# EAGLE design carrier_board_simplified (EAGLE 9.2.1)
TITLE: Carrier Board

## Sheet 1 of 3: Slot 1
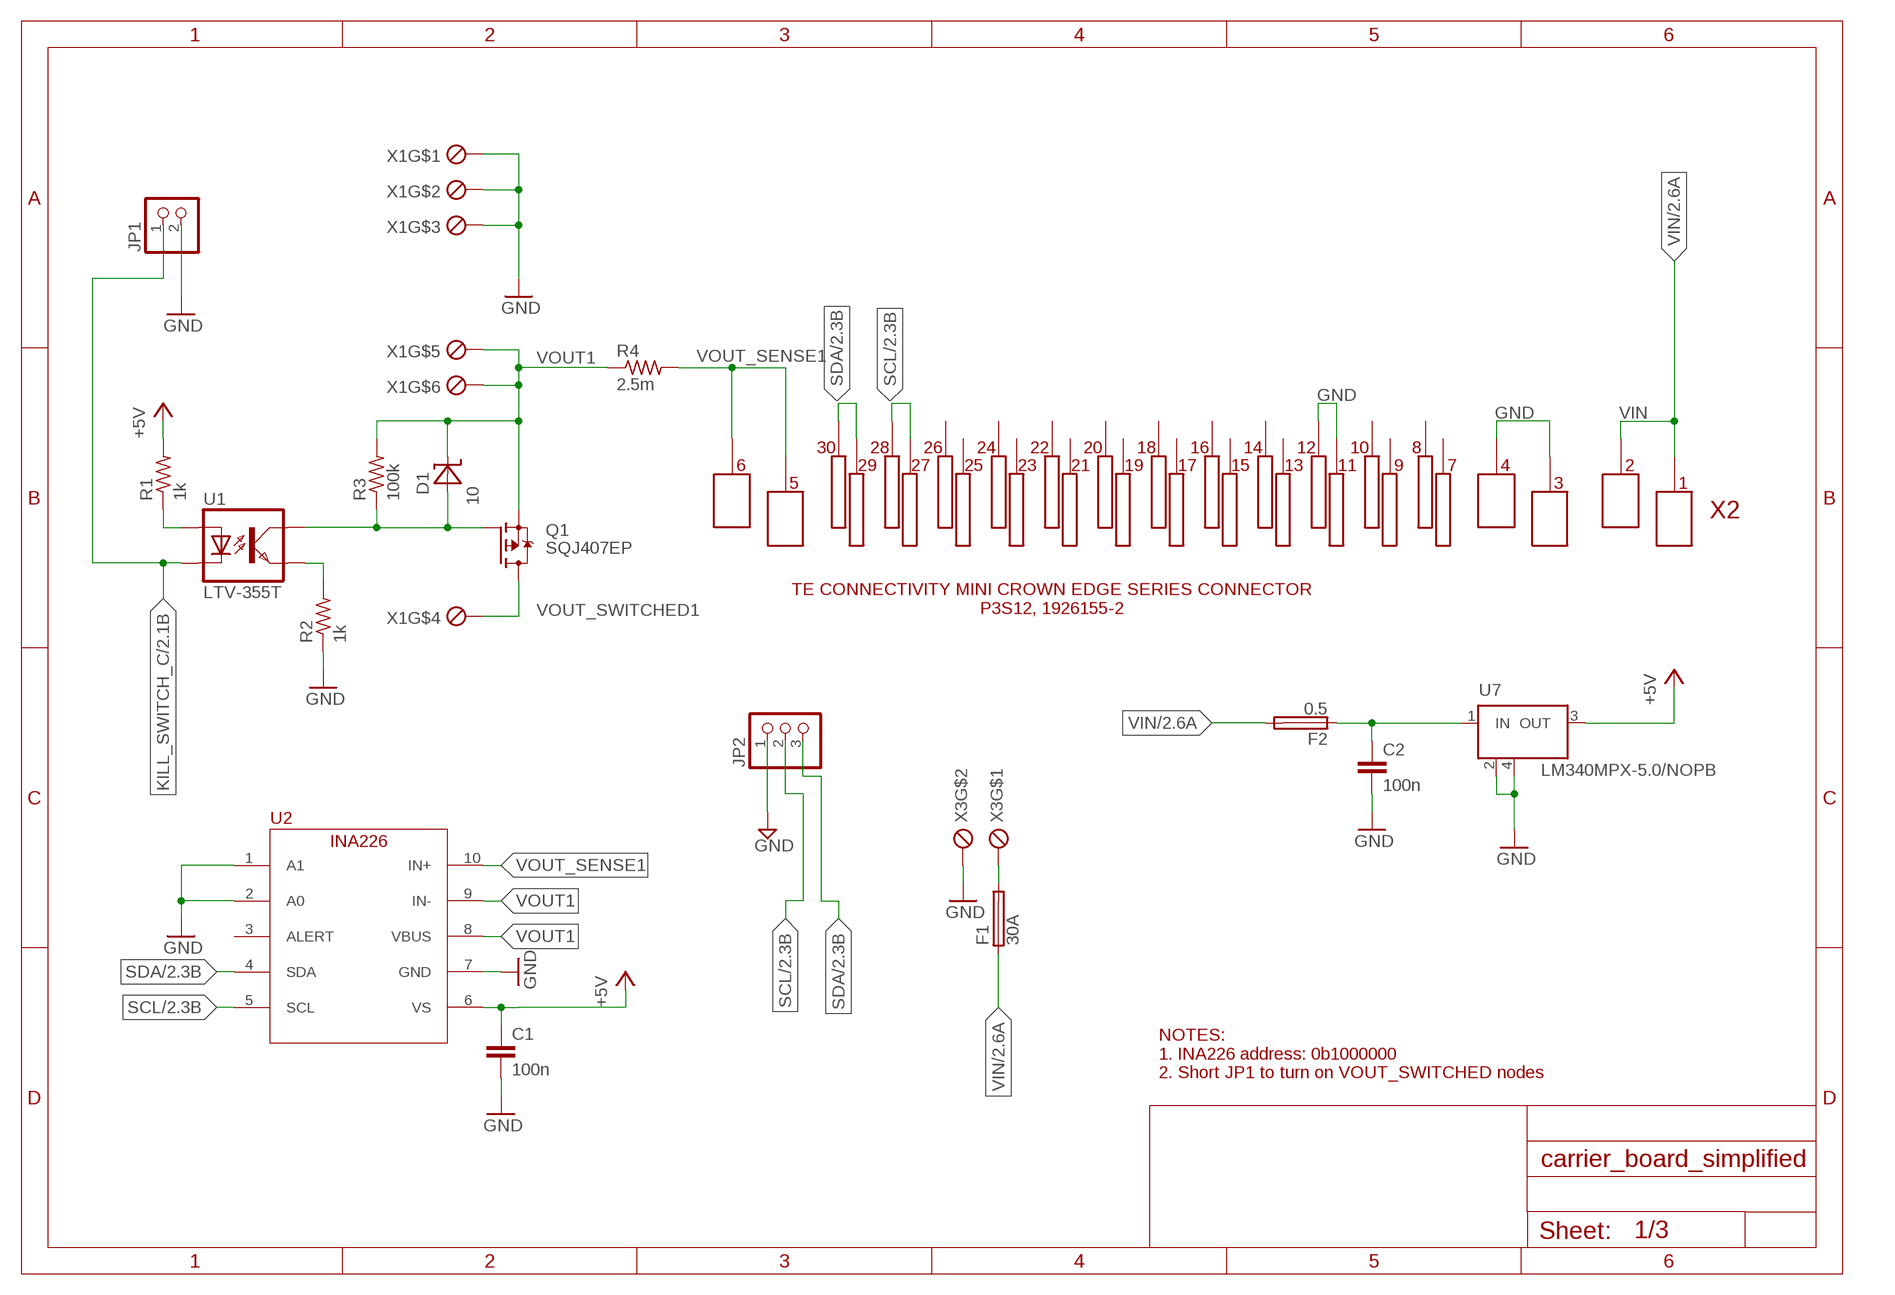
[diagram p0: schematic, sheet 1]

### Parts
C1  100n  C-EUC0603  [C0603]
C2  100n  C-EUC0603  [C0603]
D1  10  BZT52C10-TP  [SOD123]
F1  30A  3557-10  [3557-10]
F2  0.5  501_FUSE  [R1206]
JP1  PINHD-1X02_2.54-SMD-90°  [1X02SMD/90]
JP2  PINHD-1X03_2.54-SMD-90°  [1X03SMD/90]
Q1  SQJ407EP  [POWERPAK_SO8L_SINGLE]
R1  1k  R-US_R0603  [R0603]
R2  1k  R-US_R0603  [R0603]
R3  100k  R-US_R0603  [R0603]
R4  2.5m  R-US_R2512  [R2512]
U1  LTV-355T  [SMD4]
U2  INA226  [MSOP10]
U7  LM340MPX-5.0/NOPB  LM340S  [SOT223]
X1  284391-6  [284391-6]
X2  1926155-2_SOCK  [1926155-2_SOCK]
X3  OSTT7020150  [OSTT7020150]

### Nets
+5V: C1.1 R1.2 U2.6(VS) U7.3(OUT) ; also sheet 2,3
GATE_VOUT1: D1.2(A) Q1.P$4(G) R3.1 U1.COLLECTOR(COL)
GND: C1.2 C2.2 JP1.2 JP2.1 R2.1 U2.1(A1) U2.2(A0) U2.7(GND) U7.2(GND) U7.4(GND) X1.P$1 X1.P$2 X1.P$3 X2.P$3_1 X2.P$3_2 X2.P$3_3 X2.P$4_1 X2.P$4_2 X2.P$4_3 X2.P$11 X2.P$12 X3.2 ; also sheet 2,3
KILL_SWITCH_C: JP1.1 U1.CATHODE(C) ; also sheet 2,3
N$1: C2.1 F2.1 U7.1(IN)
N$2: R2.2 U1.EMITTER(EMIT)
N$4: R1.1 U1.ANODE(A)
SCL: JP2.2 U2.5(SCL) X2.P$27 X2.P$28 ; also sheet 2,3
SDA: JP2.3 U2.4(SDA) X2.P$29 X2.P$30 ; also sheet 2,3
VBAT1: F1.P$3 F1.P$4 X3.1
VIN: F1.P$1 F1.P$2 F2.2 X2.P$1_1 X2.P$1_2 X2.P$1_3 X2.P$2_1 X2.P$2_2 X2.P$2_3 ; also sheet 2,3
VOUT1: D1.1(C) Q1.P$1(S) Q1.P$2(S) Q1.P$3(S) R3.2 R4.1 U2.8(VBUS) U2.9(IN-) X1.P$5 X1.P$6
VOUT_SENSE1: R4.2 U2.10(IN+) X2.P$5_1 X2.P$5_2 X2.P$5_3 X2.P$6_1 X2.P$6_2 X2.P$6_3
VOUT_SWITCHED1: Q1.P$5(D) Q1.P$6(D) Q1.P$7(D) Q1.P$8(D) X1.P$4
Unconnected: U2.3(ALERT) X2.P$7 X2.P$8 X2.P$9 X2.P$10 X2.P$13 X2.P$14 X2.P$15 X2.P$16 X2.P$17 X2.P$18 X2.P$19 X2.P$20 X2.P$21 X2.P$22 X2.P$23 X2.P$24 X2.P$25 X2.P$26

### Notes on the sheet
- NOTES:
  1. INA226 address: 0b1000000
  2. Short JP1 to turn on VOUT_SWITCHED nodes

## Sheet 2 of 3: Slot 2
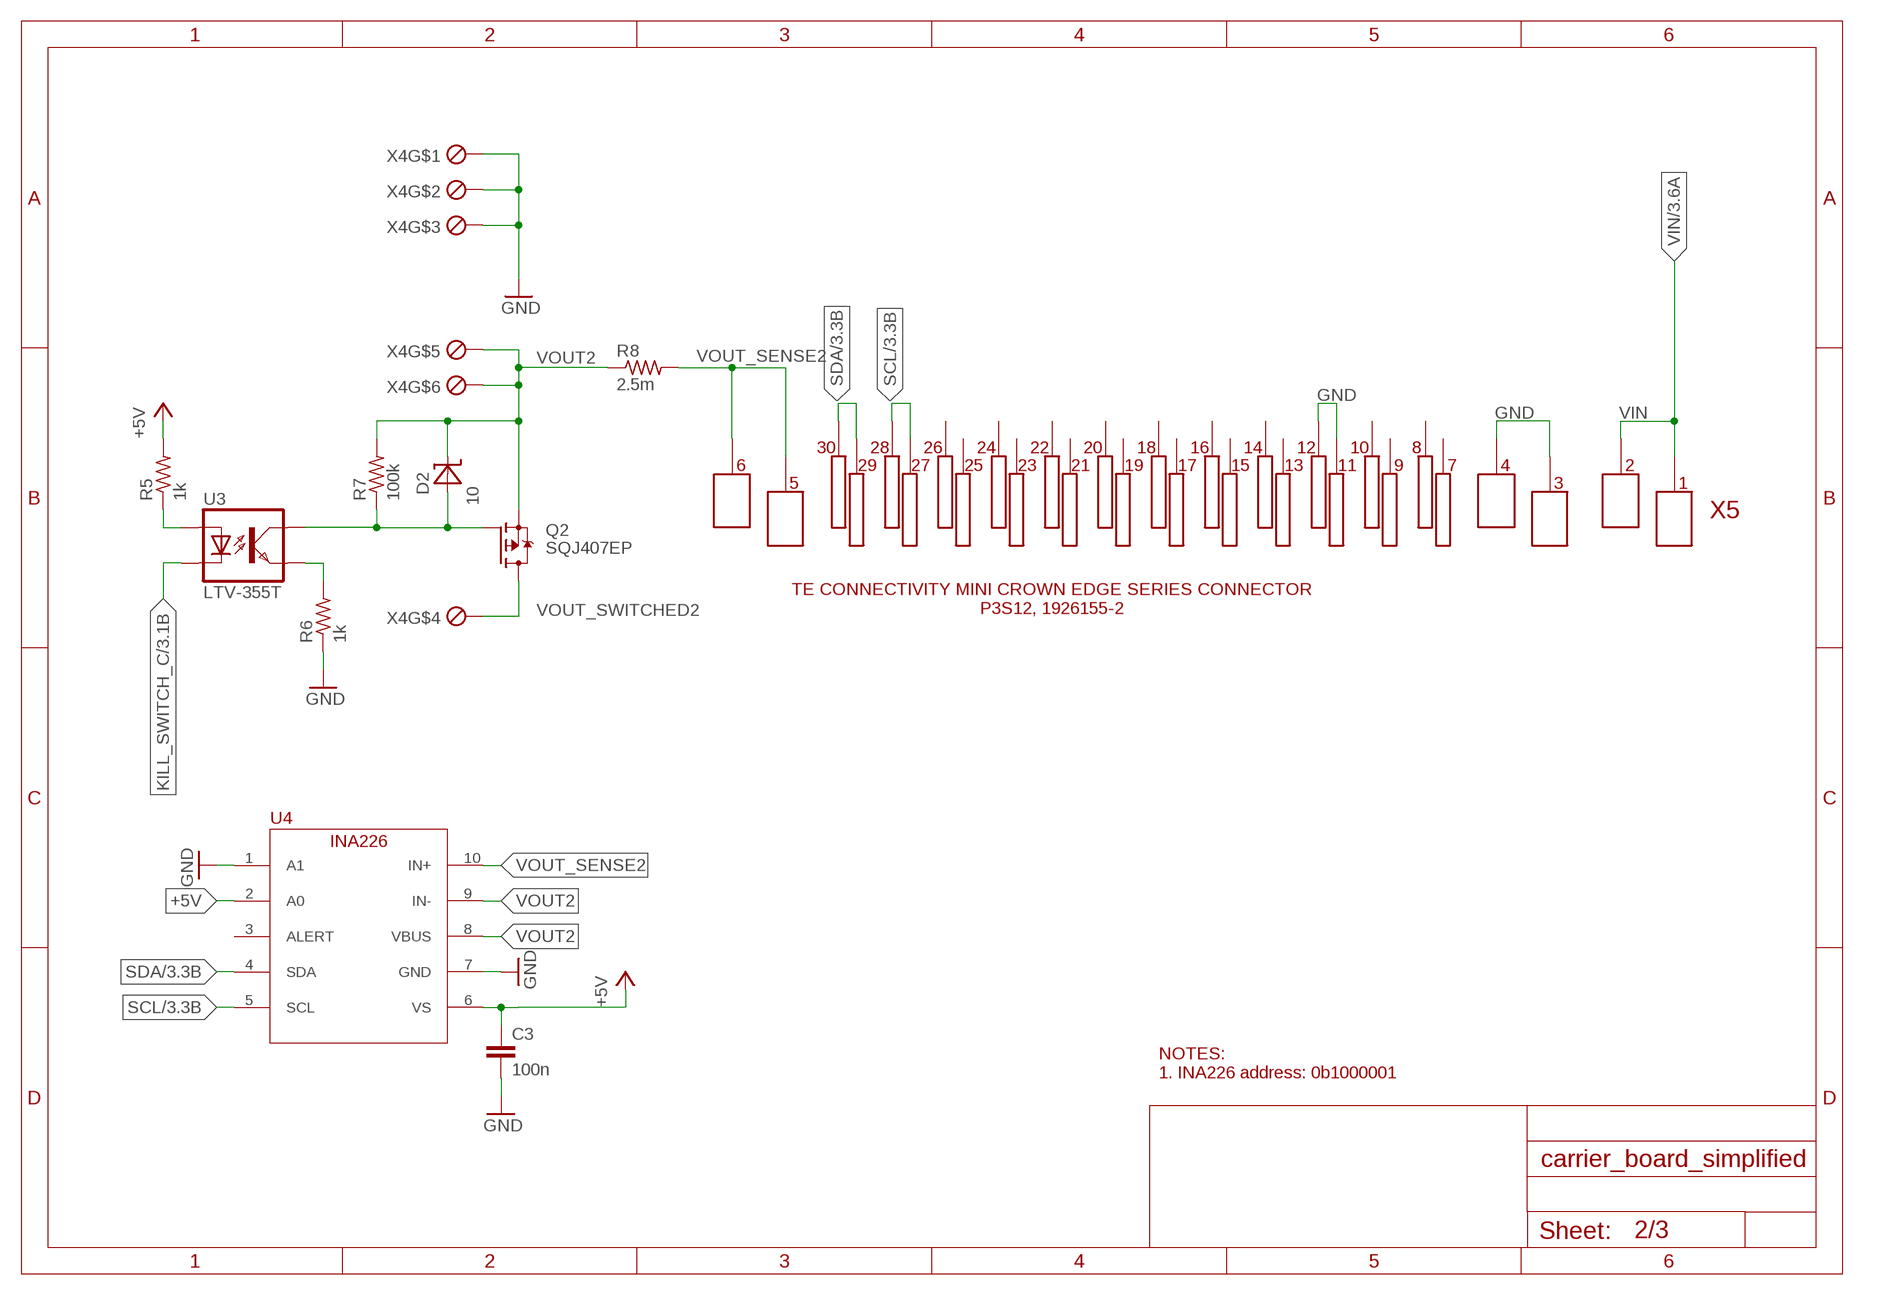
[diagram p1: schematic, sheet 2]

### Parts
C3  100n  C-EUC0603  [C0603]
D2  10  BZT52C10-TP  [SOD123]
Q2  SQJ407EP  [POWERPAK_SO8L_SINGLE]
R5  1k  R-US_R0603  [R0603]
R6  1k  R-US_R0603  [R0603]
R7  100k  R-US_R0603  [R0603]
R8  2.5m  R-US_R2512  [R2512]
U3  LTV-355T  [SMD4]
U4  INA226  [MSOP10]
X4  284391-6  [284391-6]
X5  1926155-2_SOCK  [1926155-2_SOCK]

### Nets
+5V: C3.1 R5.2 U4.2(A0) U4.6(VS) ; also sheet 1,3
GATE_VOUT2: D2.2(A) Q2.P$4(G) R7.1 U3.COLLECTOR(COL)
GND: C3.2 R6.1 U4.1(A1) U4.7(GND) X4.P$1 X4.P$2 X4.P$3 X5.P$3_1 X5.P$3_2 X5.P$3_3 X5.P$4_1 X5.P$4_2 X5.P$4_3 X5.P$11 X5.P$12 ; also sheet 1,3
KILL_SWITCH_C: U3.CATHODE(C) ; also sheet 1,3
N$7: R6.2 U3.EMITTER(EMIT)
N$8: R5.1 U3.ANODE(A)
SCL: U4.5(SCL) X5.P$27 X5.P$28 ; also sheet 1,3
SDA: U4.4(SDA) X5.P$29 X5.P$30 ; also sheet 1,3
VIN: X5.P$1_1 X5.P$1_2 X5.P$1_3 X5.P$2_1 X5.P$2_2 X5.P$2_3 ; also sheet 1,3
VOUT2: D2.1(C) Q2.P$1(S) Q2.P$2(S) Q2.P$3(S) R7.2 R8.1 U4.8(VBUS) U4.9(IN-) X4.P$5 X4.P$6
VOUT_SENSE2: R8.2 U4.10(IN+) X5.P$5_1 X5.P$5_2 X5.P$5_3 X5.P$6_1 X5.P$6_2 X5.P$6_3
VOUT_SWITCHED2: Q2.P$5(D) Q2.P$6(D) Q2.P$7(D) Q2.P$8(D) X4.P$4
Unconnected: U4.3(ALERT) X5.P$7 X5.P$8 X5.P$9 X5.P$10 X5.P$13 X5.P$14 X5.P$15 X5.P$16 X5.P$17 X5.P$18 X5.P$19 X5.P$20 X5.P$21 X5.P$22 X5.P$23 X5.P$24 X5.P$25 X5.P$26

### Notes on the sheet
- NOTES:
  1. INA226 address: 0b1000001

## Sheet 3 of 3: Slot 3
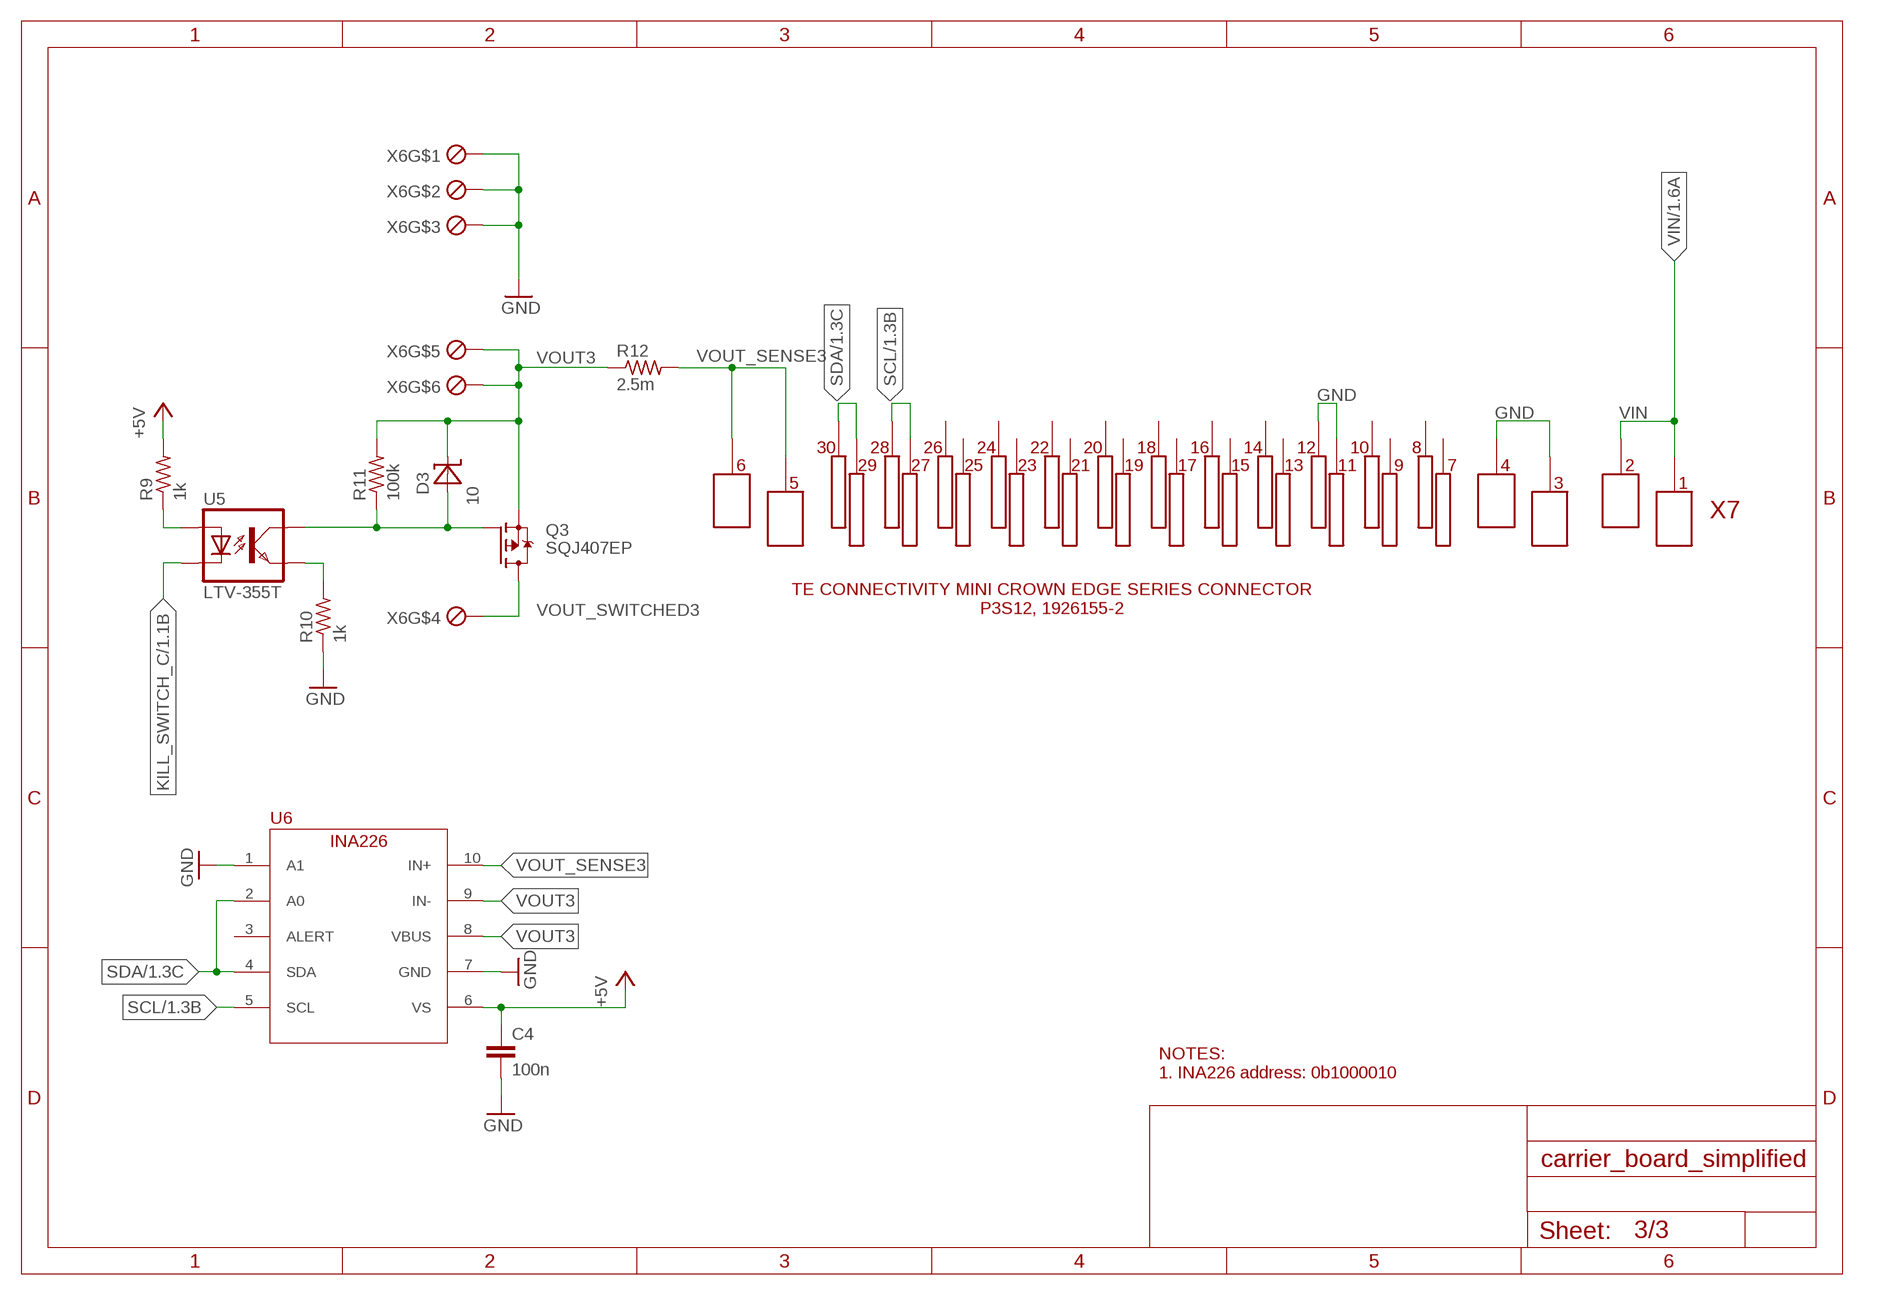
[diagram p2: schematic, sheet 3]

### Parts
C4  100n  C-EUC0603  [C0603]
D3  10  BZT52C10-TP  [SOD123]
Q3  SQJ407EP  [POWERPAK_SO8L_SINGLE]
R9  1k  R-US_R0603  [R0603]
R10  1k  R-US_R0603  [R0603]
R11  100k  R-US_R0603  [R0603]
R12  2.5m  R-US_R2512  [R2512]
U5  LTV-355T  [SMD4]
U6  INA226  [MSOP10]
X6  284391-6  [284391-6]
X7  1926155-2_SOCK  [1926155-2_SOCK]

### Nets
+5V: C4.1 R9.2 U6.6(VS) ; also sheet 1,2
GATE_VOUT3: D3.2(A) Q3.P$4(G) R11.1 U5.COLLECTOR(COL)
GND: C4.2 R10.1 U6.1(A1) U6.7(GND) X6.P$1 X6.P$2 X6.P$3 X7.P$3_1 X7.P$3_2 X7.P$3_3 X7.P$4_1 X7.P$4_2 X7.P$4_3 X7.P$11 X7.P$12 ; also sheet 1,2
KILL_SWITCH_C: U5.CATHODE(C) ; also sheet 1,2
N$13: R10.2 U5.EMITTER(EMIT)
N$14: R9.1 U5.ANODE(A)
SCL: U6.5(SCL) X7.P$27 X7.P$28 ; also sheet 1,2
SDA: U6.2(A0) U6.4(SDA) X7.P$29 X7.P$30 ; also sheet 1,2
VIN: X7.P$1_1 X7.P$1_2 X7.P$1_3 X7.P$2_1 X7.P$2_2 X7.P$2_3 ; also sheet 1,2
VOUT3: D3.1(C) Q3.P$1(S) Q3.P$2(S) Q3.P$3(S) R11.2 R12.1 U6.8(VBUS) U6.9(IN-) X6.P$5 X6.P$6
VOUT_SENSE3: R12.2 U6.10(IN+) X7.P$5_1 X7.P$5_2 X7.P$5_3 X7.P$6_1 X7.P$6_2 X7.P$6_3
VOUT_SWITCHED3: Q3.P$5(D) Q3.P$6(D) Q3.P$7(D) Q3.P$8(D) X6.P$4
Unconnected: U6.3(ALERT) X7.P$7 X7.P$8 X7.P$9 X7.P$10 X7.P$13 X7.P$14 X7.P$15 X7.P$16 X7.P$17 X7.P$18 X7.P$19 X7.P$20 X7.P$21 X7.P$22 X7.P$23 X7.P$24 X7.P$25 X7.P$26

### Notes on the sheet
- NOTES:
  1. INA226 address: 0b1000010

## Library data of the parts
C1-C4 = rcl:C-EU: CAPACITOR, European symbol; SPICEPREFIX: C
D1-D3 = LTM4607:BZT52C10-TP
F1 = LTM4607:3557-10
F2 = LTM4607:501_FUSE
JP1 = pinhead-2:PINHD-1X02: PIN HEADER
JP2 = pinhead-2:PINHD-1X03: PIN HEADER
Q1-Q3 = LTM4607:SQJ407EP
R1-R12 = rcl:R-US_: RESISTOR, American symbol; SPICEPREFIX: R
U1 U3 U5 = dropper_torpedo_v3:LTV-355T
U2 U4 U6 = LTM4607:INA226
U7 = linear:LM340S: 3-Terminal Positive Regulators Source: http://cache.national.com/ds/LM/LM340.pdf
X1 X4 X6 = LTM4607:284391-6
X2 X5 X7 = LTM4607:1926155-2_SOCK
X3 = LTM4607:OSTT7020150

## Net classes
1 net1: clearance 0.203 mm to class 0

## Board
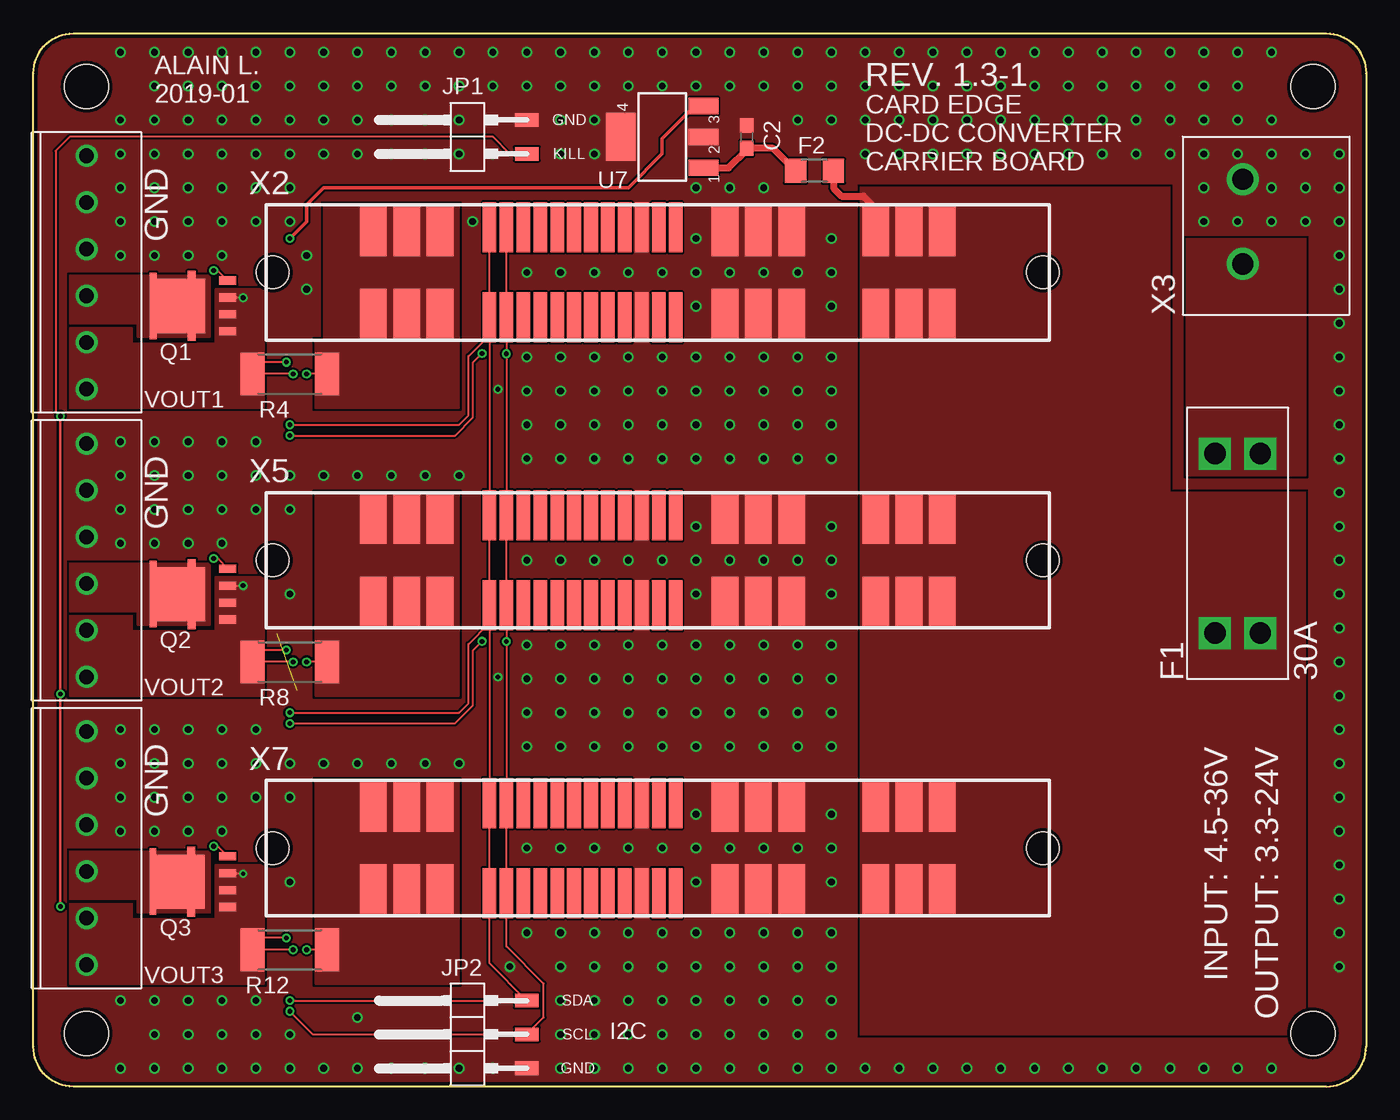
[diagram p3: board, top side]
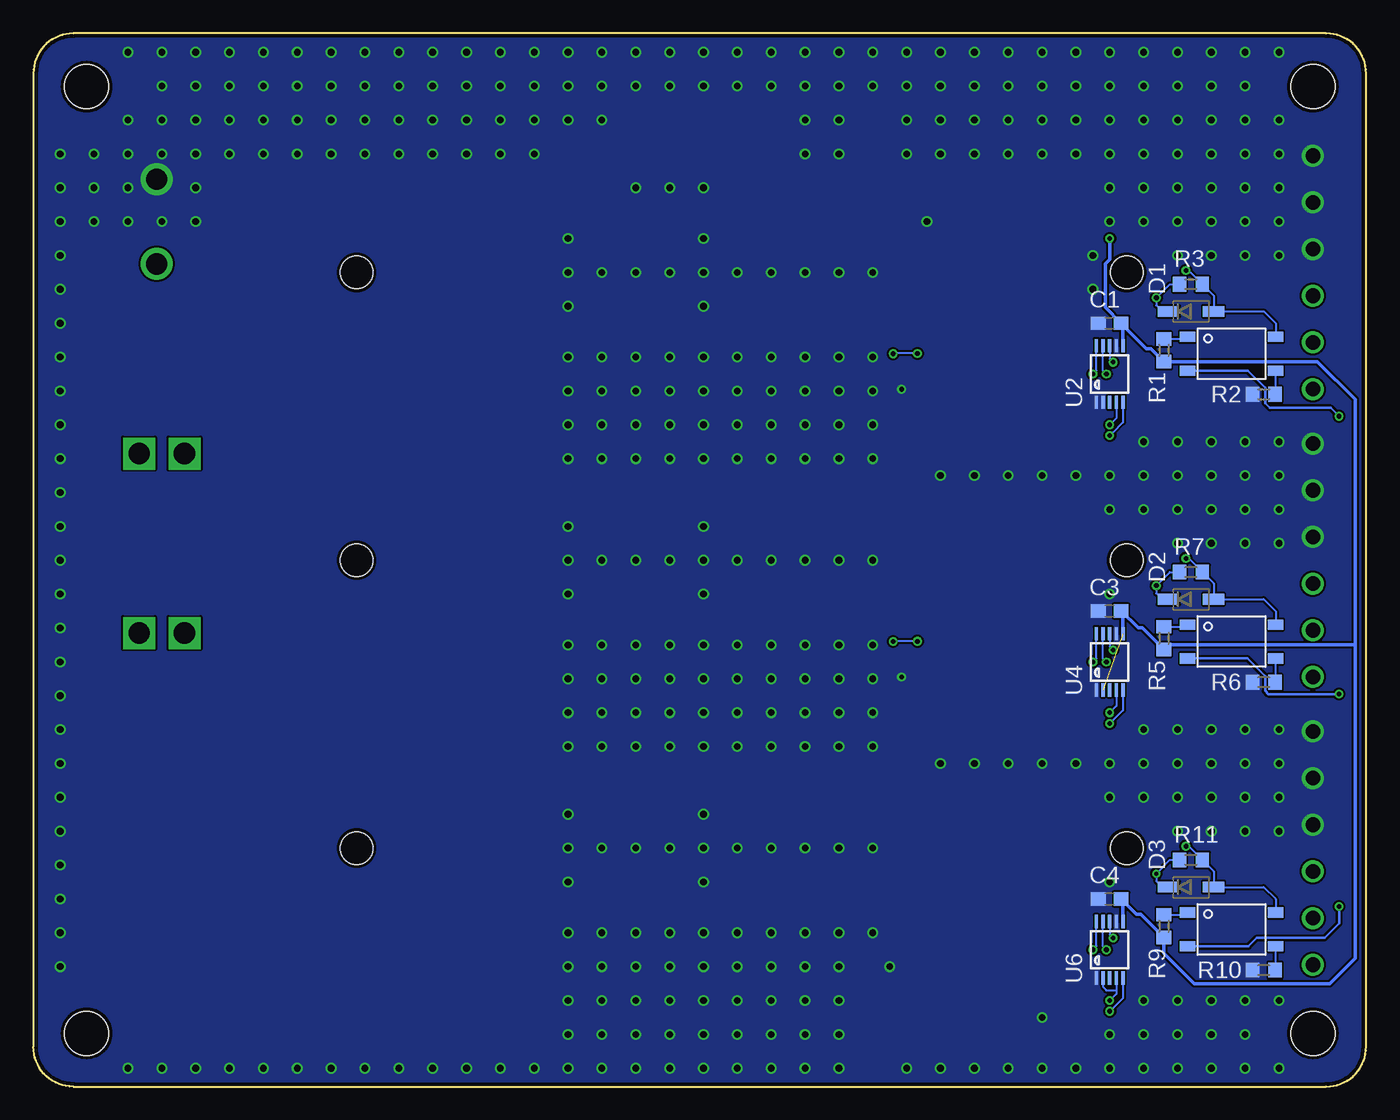
[diagram p4: board, bottom side, seen from below]

Size 100 x 79 mm. Coordinates in mm from the lower left corner, seen from the top.
Outline: 0,3 0,76 arc-90 3,79 97,79 arc-90 100,76 100,3 arc-90 97,0 3,0 arc-90 0,3
Copper layers (1*16): Top 0.035mm / dielectric 1.5mm / Bottom 0.035mm
Design rules "JLCPCB2Layer *": minimum track width 6mil, minimum drill 10mil, track to track 6mil, track to pad 6mil, pad to pad 6mil, via to via 6mil, smd to smd 0mil, copper to edge 10mil, drill to drill 10mil, minimum pad ring 6mil, minimum via ring 6mil, stop-mask expansion 2mil, vias tented up to drill 100mil, thermal gap 10mil

### Footprints (pad centres in the part's own frame; a part is rotated, then mirrored left to right if it is on the bottom)
C0603 = smd 1.1 x 1: 1 -0.85,0; 2 0.85,0
SOD123 = smd 1.6 x 0.8: 1 -1.7,0; 2 1.7,0
3557-10 = drill 1.6 square: P$1 -6.731,-1.702; P$2 -6.731,1.702; P$3 6.731,-1.702; P$4 6.731,1.702
R1206 = smd 1.6 x 1.803: 1 -1.422,0; 2 1.422,0
1X02SMD/90 = smd 1.016 x 1.778: 1 -1.27,-5.08; 2 1.27,-5.08
1X03SMD/90 = smd 1.016 x 1.778: 1 -1.27,-5.08; 2 1.27,-5.08; 3 3.81,-5.08
POWERPAK_SO8L_SINGLE = smd 0.61 x 1.27: P$1 -1.905,0; P$2 -0.635,0; P$3 0.635,0; P$4 1.905,0 | smd 4.061 x 3.63: P$5 0,3.527 | smd 0.595 x 0.61: P$6 -2.328,2.715; P$7 2.328,2.715 | smd 5 x 0.51: P$8 0,5.596
R0603 = smd 1 x 1.1: 1 -0.85,0; 2 0.85,0
R2512 = smd 1.8 x 3.2: 1 -2.8,0; 2 2.8,0
SMD4 = smd 0.762 x 1.143: ANODE -1.27,-3.302; CATHODE 1.27,-3.302; COLLECTOR -1.27,3.302; EMITTER 1.27,3.302
MSOP10 = smd 0.25 x 1: 1 -1,-2.113; 2 -0.5,-2.113; 3 0,-2.113; 4 0.5,-2.113; 5 1,-2.113; 6 1,2.113; 7 0.5,2.113; 8 0,2.113; 9 -0.5,2.113; 10 -1,2.113
SOT223 = smd 1.219 x 2.235: 1 -2.311,-3.099; 2 0,-3.099; 3 2.311,-3.099 | smd 3.6 x 2.2: 4 0,3.099
STAND-OFF = hole 3.302: 0,0
284391-6 = drill 1.1: P$1 -8.75,0; P$2 -5.25,0; P$3 -1.75,0; P$4 1.75,0; P$5 5.25,0; P$6 8.75,0
1926155-2_SOCK = smd 2 x 3.75: P$1_1 50.22,-3.1; P$1_2 47.72,-3.1; P$1_3 45.22,-3.1; P$2_1 50.22,3.1; P$2_2 47.72,3.1; P$2_3 45.22,3.1; P$3_1 38.92,-3.1; P$3_2 36.42,-3.1; P$3_3 33.92,-3.1; P$4_1 38.92,3.1; P$4_2 36.42,3.1; P$4_3 33.92,3.1; P$5_1 12.55,-3.1; P$5_2 10.05,-3.1; P$5_3 7.55,-3.1; P$6_1 12.55,3.1; P$6_2 10.05,3.1; P$6_3 7.55,3.1 | smd 1.02 x 3.75: P$7 30.22,-3.375; P$8 30.22,3.375; P$9 28.95,-3.375; P$10 28.95,3.375; P$11 27.68,-3.375; P$12 27.68,3.375; P$13 26.41,-3.375; P$14 26.41,3.375; P$15 25.14,-3.375; P$16 25.14,3.375; P$17 23.87,-3.375; P$18 23.87,3.375; P$19 22.6,-3.375; P$20 22.6,3.375; P$21 21.33,-3.375; P$22 21.33,3.375; P$23 20.06,-3.375; P$24 20.06,3.375; P$25 18.79,-3.375; P$26 18.79,3.375; P$27 17.52,-3.375; P$28 17.52,3.375; P$29 16.25,-3.375; P$30 16.25,3.375 | hole 2.44: 57.77,0; 0,0
OSTT7020150 = drill 1.6: 1 0,0; 2 6.35,0

### Placement (x,y rotation side)
C1  19.24,57.26 180 bottom
C2  53.53,71.23 90 top
C3  19.24,35.67 180 bottom
C4  19.24,14.08 180 bottom
D1  13.14,58.15 0 bottom
D2  13.14,36.56 0 bottom
D3  13.14,14.97 0 bottom
F1  90.36,40.75 90 top
F2  58.61,68.69 0 top
JP1  31.94,71.23 90 top
JP2  31.94,2.65 90 top
Q1  14.59,58.56 90 top
Q2  14.59,36.94 90 top
Q3  14.57,15.38 90 top
R1  15.18,55.23 270 bottom
R2  7.68,51.93 0 bottom
R3  13.14,60.18 180 bottom
R4  19.24,53.45 0 top
R5  15.18,33.64 270 bottom
R6  7.68,30.34 0 bottom
R7  13.14,38.59 180 bottom
R8  19.24,31.86 0 top
R9  15.18,12.05 270 bottom
R10  7.68,8.75 0 bottom
R11  13.14,17 180 bottom
R12  19.24,10.27 0 top
U1  10.1,54.97 270 bottom
U2  19.24,53.45 0 bottom
U3  10.1,33.38 270 bottom
U4  19.24,31.86 0 bottom
U5  10.1,11.79 270 bottom
U6  19.24,10.27 0 bottom
U7  47.18,71.23 90 top
U$1  [STAND-OFF]  4,4 0 top
U$2  [STAND-OFF]  96,4 0 top
U$3  [STAND-OFF]  4,75 0 top
U$4  [STAND-OFF]  96,75 0 top
U$5  [A4L-LOC]  -50.61,-49.42 0 top  (outside the outline)
X1  4,61.07 270 top
X2  17.97,61.07 0 top
X3  90.74,61.7 90 top
X4  4,39.48 270 top
X5  17.97,39.48 0 top
X6  4,17.89 270 top
X7  17.97,17.89 0 top

### Tracks (layer width: path | path; a pad name or v marks a point on that pad's centre or on a via)
+5V  (via drill 0.35)  (1 unrouted)
  Top 0.254: U7.3 49.62,73.54 47.18,71.1 47.18,69.96 44.64,67.42 21.78,67.42 20.51,66.15 20.51,64.88 v19.24,63.61
  Bottom 0.254: v19.24,63.61 19.24,62.06 19.57,61.73 19.57,58.44 C1.1 | C1.1 18.24,57.11 U2.6 | C1.1 16.48,55.36 16.15,55.36 R1.2 3.66,54.38 0.83,51.55 0.83,33.13 | 0.83,33.13 0.83,9.63 2.73,7.73 12.89,7.73 15.18,10.02 R9.2 16.92,12.94 17.25,12.94 C4.1 18.24,13.93 U6.6 | U4.6 18.24,35.52 C3.1 18.35,35.67 17.08,34.4 16.79,34.4 R5.2 14.83,33.13 4.46,33.13 3.54,33.13 0.83,33.13
GATE_VOUT1  (via drill 0.35)
  Top 0.152: Q1.P$4 13.84,61.21 v13.53,61.21
  Bottom 0.152: U1.COLLECTOR 6.79,57.26 7.68,58.15 D1.2 11.44,59.33 R3.1 13.32,61.21 v13.53,61.21
GATE_VOUT2  (via drill 0.35)
  Top 0.152: Q2.P$4 13.82,39.62 v13.53,39.62
  Bottom 0.152: U3.COLLECTOR 6.79,35.67 7.68,36.56 D2.2 11.44,37.74 R7.1 13.32,39.62 v13.53,39.62
GATE_VOUT3  (via drill 0.35)
  Top 0.152: Q3.P$4 13.82,18.03 v13.53,18.03
  Bottom 0.152: U5.COLLECTOR 6.79,14.08 7.68,14.97 D3.2 11.44,16.15 R11.1 13.32,18.03 v13.53,18.03
GND  (via drill 0.35, 0.5)
  other vias: 19.24,64.88 16.7,64.88 14.16,64.88 11.62,64.88 9.08,64.88 6.54,64.88 6.54,62.34 9.08,62.34 11.62,62.34 14.16,62.34 20.51,62.34 20.51,59.8 6.54,48.37 9.08,48.37 11.62,48.37 14.16,48.37 16.7,48.37 16.7,45.83 14.16,45.83 11.62,45.83 9.08,45.83 6.54,45.83 6.54,43.29 9.08,43.29 11.62,43.29 14.16,43.29 16.7,43.29 19.24,43.29 19.24,45.83 21.78,45.83 24.32,45.83 26.86,45.83 29.4,45.83 31.94,45.83 6.54,40.75 9.08,40.75 11.62,40.75 14.16,40.75 6.54,26.78 9.08,26.78 11.62,26.78 14.16,26.78 14.16,24.24 11.62,24.24 9.08,24.24 6.54,24.24 6.54,21.7 9.08,21.7 11.62,21.7 14.16,21.7 6.54,19.16 9.08,19.16 11.62,19.16 14.16,19.16 16.7,26.78 16.7,24.24 16.7,21.7 19.24,21.7 19.24,24.24 21.78,24.24 24.32,24.24 26.86,24.24 29.4,24.24 31.94,24.24 49.72,33.13 52.26,33.13 54.8,33.13 57.34,33.13 57.34,30.59 54.8,30.59 52.26,30.59 49.72,30.59 49.72,28.05 52.26,28.05 54.8,28.05 57.34,28.05 49.72,25.51 52.26,25.51 54.8,25.51 57.34,25.51 44.64,33.13 47.18,33.13 47.18,30.59 44.64,30.59 44.64,28.05 47.18,28.05 44.64,25.51 47.18,25.51 59.88,33.13 59.88,30.59 59.88,28.05 59.88,25.51 49.72,54.72 52.26,54.72 54.8,54.72 57.34,54.72 57.34,52.18 54.8,52.18 52.26,52.18 49.72,52.18 49.72,49.64 52.26,49.64 54.8,49.64 57.34,49.64 49.72,47.1 52.26,47.1 54.8,47.1 57.34,47.1 44.64,54.72 47.18,54.72 47.18,52.18 44.64,52.18 44.64,49.64 47.18,49.64 44.64,47.1 47.18,47.1 59.88,54.72 59.88,52.18 59.88,49.64 59.88,47.1 49.72,11.54 52.26,11.54 54.8,11.54 57.34,11.54 57.34,9 54.8,9 52.26,9 49.72,9 49.72,6.46 52.26,6.46 54.8,6.46 57.34,6.46 49.72,3.92 52.26,3.92 54.8,3.92 57.34,3.92 44.64,11.54 47.18,11.54 47.18,9 44.64,9 44.64,6.46 47.18,6.46 44.64,3.92 47.18,3.92 59.88,11.54 59.88,9 59.88,6.46 59.88,3.92 42.1,11.54 39.56,11.54 37.02,11.54 39.56,9 42.1,9 42.1,6.46 42.1,3.92 42.1,1.38 44.64,1.38 47.18,1.38 49.72,1.38 52.26,1.38 54.8,1.38 57.34,1.38 59.88,1.38 62.42,1.38 64.96,1.38 67.5,1.38 70.04,1.38 72.58,1.38 75.12,1.38 77.66,1.38 80.2,1.38 85.28,1.38 82.74,1.38 87.82,1.38 90.36,1.38 92.9,1.38 39.56,1.38 34.48,1.38 31.94,1.38 29.4,1.38 26.86,1.38 24.32,1.38 21.78,1.38 19.24,1.38 16.7,1.38 14.16,1.38 11.62,1.38 9.08,1.38 6.54,1.38 11.62,3.92 97.98,9 97.98,11.54 97.98,14.08 97.98,16.62 97.98,19.16 97.98,21.7 97.98,24.24 97.98,26.78 97.98,29.32 97.98,31.86 97.98,34.4 97.98,36.94 97.98,39.48 97.98,42.02 97.98,47.1 97.98,44.56 97.98,49.64 97.98,52.18 97.98,54.72 97.98,57.26 97.98,59.8 59.88,20.43 59.88,17.89 59.88,15.35 57.34,17.89 54.8,17.89 52.26,17.89 49.72,17.89 49.72,20.43 49.72,15.35 59.88,39.48 59.88,36.94 59.88,42.02 57.34,39.48 54.8,39.48 52.26,39.48 49.72,39.48 49.72,42.02 49.72,36.94 59.88,61.07 57.34,61.07 59.88,63.61 59.88,58.53 54.8,61.07 52.26,61.07 49.72,61.07 49.72,63.61 49.72,58.53 6.54,6.46 37.02,54.72 34.86,52.31 34.86,30.72 19.24,15.35 19.24,36.94 32.96,64.88 97.98,64.88 97.98,62.34 14.16,3.92 16.7,3.92 19.24,3.92 24.32,5.19 39.56,6.46 39.56,3.92 14.16,6.46 16.7,6.46 42.1,33.13 42.1,30.59 42.1,28.05 42.1,25.51 37.02,33.13 39.56,33.13 39.56,30.59 37.02,30.59 37.02,28.05 39.56,28.05 37.02,25.51 39.56,25.51 42.1,54.72 42.1,52.18 42.1,49.64 42.1,47.1 39.56,54.72 39.56,52.18 37.02,52.18 37.02,49.64 39.56,49.64 37.02,47.1 39.56,47.1 35.75,9 11.62,67.42 9.08,67.42 6.54,67.42 14.16,67.42 16.7,67.42 19.24,67.42 19.24,69.96 16.7,69.96 14.16,69.96 11.62,69.96 9.08,69.96 6.54,69.96 21.78,69.96 24.32,69.96 26.86,69.96 29.4,69.96 31.94,69.96 34.48,69.96 39.56,69.96 42.1,69.96 42.1,72.5 39.56,72.5 6.54,72.5 9.08,72.5 11.62,72.5 14.16,72.5 16.7,72.5 19.24,72.5 21.78,72.5 24.32,72.5 26.86,72.5 29.4,72.5 31.94,72.5 34.48,72.5 9.08,75.04 9.08,77.58 11.62,77.58 11.62,75.04 14.16,75.04 14.16,77.58 16.7,77.58 16.7,75.04 19.24,75.04 19.24,77.58 21.78,77.58 21.78,75.04 24.32,75.04 24.32,77.58 26.86,77.58 26.86,75.04 29.4,75.04 29.4,77.58 31.94,77.58 31.94,75.04 34.48,75.04 34.48,77.58 37.02,77.58 37.02,75.04 39.56,75.04 39.56,77.58 42.1,77.58 42.1,75.04 44.64,75.04 44.64,77.58 47.18,77.58 47.18,75.04 49.72,75.04 49.72,77.58 52.26,77.58 52.26,75.04 54.8,75.04 54.8,77.58 57.34,77.58 57.34,75.04 57.34,72.5 59.88,72.5 59.88,75.04 59.88,77.58 62.42,77.58 62.42,75.04 62.42,72.5 62.42,69.96 64.96,69.96 64.96,72.5 64.96,75.04 64.96,77.58 67.5,77.58 67.5,75.04 67.5,72.5 67.5,69.96 70.04,69.96 70.04,72.5 70.04,75.04 70.04,77.58 72.58,77.58 72.58,75.04 72.58,72.5 72.58,69.96 75.12,69.96 75.12,72.5 75.12,75.04 75.12,77.58 77.66,77.58 77.66,75.04 77.66,72.5 77.66,69.96 80.2,69.96 80.2,72.5 80.2,75.04 80.2,77.58 82.74,77.58 82.74,75.04 82.74,72.5 82.74,69.96 85.28,69.96 85.28,72.5 85.28,75.04 85.28,77.58 87.82,72.5 87.82,75.04 87.82,77.58 90.36,77.58 90.36,75.04 90.36,72.5 92.9,72.5 92.9,77.58 6.54,77.58 54.8,67.42 52.26,67.42 49.72,67.42 97.98,67.42 97.98,69.96 95.44,69.96 92.9,69.96 92.9,67.42 92.9,64.88 95.44,64.88 95.44,67.42 90.36,69.96 90.36,64.88 87.82,64.88 87.82,67.42 87.82,69.96 47.18,61.07 44.64,61.07 42.1,61.07 39.56,61.07 37.02,61.07 47.18,39.48 44.64,39.48 42.1,39.48 39.56,39.48 37.02,39.48 47.18,17.89 44.64,17.89 42.1,17.89 39.56,17.89 37.02,17.89 11.62,6.46 9.08,6.46 9.08,3.92
  pour Top (rank 6, no thermals): 0,79 0,0 100,0 100,79
  pour Bottom (rank 6, no thermals): 0,79 0,0 100,0 100,79
KILL_SWITCH_C  (via drill 0.35)
  Top 0.152: v2.03,50.27 1.68,50.63 1.68,70.18 2.73,71.23 34.48,71.23 35.75,69.96 JP1.1
  Top 0.203: v2.03,50.27 v2.03,29.45 v2.03,13.51
  Bottom 0.203: U5.CATHODE 8.83,10.52 8.19,11.16 3.11,11.16 2.03,12.24 v2.03,13.51 | v2.03,50.27 2.67,50.91 7.23,50.91 7.59,51.27 7.59,52.4 8.89,53.7 U1.CATHODE | U3.CATHODE 8.9,32.11 7.59,30.8 7.59,29.68 7.35,29.45 v2.03,29.45
N$1
  Top 0.508: U7.1 52.17,68.92 53.53,70.28 C2.1 55.5,70.38 55.6,70.28 55.99,69.88 F2.1
N$2
  Bottom 0.152: R2.2 6.79,51.93 U1.EMITTER
N$4
  Bottom 0.152: R1.1 13.4,56.08 U1.ANODE
N$7
  Bottom 0.152: R6.2 6.79,30.34 U3.EMITTER
N$8
  Bottom 0.152: R5.1 13.4,34.49 U3.ANODE
N$13
  Bottom 0.152: R10.2 6.79,8.75 U5.EMITTER
N$14
  Bottom 0.152: R9.1 13.4,12.9 U5.ANODE
SCL  (via drill 0.35)
  Top 0.152: v33.66,33.4 32.99,32.73 32.99,28.6 31.63,27.24 v19.24,27.24 | v33.66,54.99 32.99,54.32 32.99,50.19 31.63,48.83 v19.24,48.83 | X2.P$28 X2.P$27 v35.49,54.97 X5.P$28 X5.P$27 v35.49,33.38 X7.P$28 X7.P$27 35.5,10.52 38.29,7.73 38.29,5.19 JP2.2 20.97,3.92 v19.24,5.65
  Bottom 0.152: v19.24,5.65 19.01,5.88 19,5.88 18.24,6.64 U6.5 | v19.24,27.24 19.01,27.47 19,27.47 18.24,28.23 U4.5 | v33.66,33.4 35.47,33.4 v35.49,33.38 | v19.24,48.83 19.01,49.06 19,49.06 18.24,49.82 U2.5 | v33.66,54.99 35.47,54.99 v35.49,54.97
SDA  (via drill 0.35)
  Top 0.152: X2.P$29 X5.P$30 X5.P$29 34.22,34.77 | 34.22,34.77 X7.P$30 X7.P$29 34.22,9.26 JP2.3 v19.24,6.46 | v19.24,28.05 31.94,28.05 32.64,28.75 32.64,33.19 34.22,34.77 | v19.24,49.64 31.94,49.64 32.64,50.34 32.64,54.78 34.22,56.36 X2.P$29 | X2.P$29 X2.P$30
  Bottom 0.152: U6.4 18.74,7.22 | 18.74,7.22 18.74,6.96 v19.24,6.46 | U4.4 18.74,28.55 v19.24,28.05 | U2.4 18.74,50.14 v19.24,49.64 | U6.2 19.75,7.48 19.49,7.22 18.74,7.22
VBAT1
  pour Top (no thermals): 86.55,63.61 95.44,63.61 95.44,45.83 86.55,45.83
VIN
  Top 0.508: F2.2 60.03,67.39 60.64,66.78 62.29,66.78 63.19,65.89 X2.P$2_3
  pour Top (rank 2, no thermals): 95.44,44.56 85.28,44.56 85.28,67.42 62.04,67.42 62.04,3.92 95.44,3.92
VOUT1  (via drill 0.35)
  Top 0.152: R4.1 | v19.49,53.45 R4.1 | v18.99,54.34 16.83,54.34 | Q1.P$3 15.72,59.19 v15.75,59.16
  Bottom 0.152: v19.49,53.45 19.74,53.7 U2.9 | U2.8 19.24,54.59 v18.99,54.34 | R3.2 14.73,60.18 v15.75,59.16 15.75,58.59 15.3,58.15 D1.1 14.84,58.26
  pour Top (no thermals): 17.33,50.91 17.33,59.8 13.65,59.8 13.65,55.74 7.43,55.74 7.43,56.88 2.73,56.88 2.73,50.91
VOUT2  (via drill 0.35)
  Top 0.152: R8.1 | v19.49,31.86 R8.1 | v18.99,32.75 16.83,32.75 | Q2.P$3 v15.75,37.58
  Bottom 0.152: v19.49,31.86 19.74,32.11 U4.9 | U4.8 19.24,33 v18.99,32.75 | 14.84,36.67 D2.1 15.3,36.56 15.75,37 v15.75,37.58 14.73,38.59 R7.2
  pour Top (no thermals): 17.33,29.32 17.33,38.21 13.65,38.21 13.65,34.15 7.43,34.15 7.43,35.29 2.73,35.29 2.73,29.32
VOUT3  (via drill 0.3, 0.35)
  Top 0.152: R12.1 | v19.49,10.27 R12.1 | v18.99,11.16 16.83,11.16 | Q3.P$3 15.72,16.01 v15.75,15.98
  Bottom 0.152: v19.49,10.27 19.74,10.52 U6.9 | U6.8 19.24,11.41 v18.99,11.16 | 14.84,15.08 D3.1 15.3,14.97 15.75,15.41 v15.75,15.98 14.73,17 R11.2
  pour Top (no thermals): 17.33,7.73 17.33,16.62 13.65,16.62 13.65,12.56 7.43,12.56 7.43,13.7 2.73,13.7 2.73,7.73
VOUT_SENSE1  (via drill 0.35)
  Top 0.152: R4.2 v20.51,53.45
  Bottom 0.152: v20.51,53.45 20.24,53.72 U2.10
  pour Top (no thermals): 31.94,66.15 21.78,66.15 21.78,55.99 21.14,55.99 21.14,50.91 31.94,50.91
VOUT_SENSE2  (via drill 0.35)
  Top 0.152: R8.2 v20.51,31.86
  Bottom 0.152: v20.51,31.86 20.24,32.13 U4.10
  pour Top (no thermals): 31.94,44.56 21.14,44.56 21.14,29.32 31.94,29.32
VOUT_SENSE3  (via drill 0.35)
  Top 0.152: R12.2 v20.51,10.27
  Bottom 0.152: v20.51,10.27 20.24,10.54 U6.10
  pour Top (no thermals): 31.94,22.97 21.14,22.97 21.14,7.73 31.94,7.73
VOUT_SWITCHED1
  pour Top (no thermals): 2.73,57.26 7.81,57.26 7.81,56.24 13.27,56.24 13.27,60.82 2.73,60.82
VOUT_SWITCHED2
  pour Top (no thermals): 2.73,35.67 7.81,35.67 7.81,34.65 13.27,34.65 13.27,39.23 2.73,39.23
VOUT_SWITCHED3
  pour Top (no thermals): 2.73,14.08 7.81,14.08 7.81,13.06 13.27,13.06 13.27,17.64 2.73,17.64

### Text on the board
tPlace: REV. 1.3-1 | ALAIN L. / 2019-01 | CARD EDGE / DC-DC CONVERTER / CARRIER BOARD | GND | VOUT1 | GND | VOUT2 | INPUT: 4.5-36V | OUTPUT: 3.3-24V | GND | VOUT3
tNames: GND | KILL | SDA | I2C | SCL | GND
Document: NOTES: / 1. Solder board in following order: / 1.1 Reflow solder top surface mounted components / except edge connectors / 1.2 Hand solder bottom components / 1.3 Hand solder remaining top components / 1.3.1 Solder edge connectors first / 2. Use LP MINI 891 fuses for F1 through F5 / 3. 2oz copper suggested, but not required